# Altium schematic sheet wifi.schdoc
size A3; Hw_rev: 0; License: GPLv3; Address3: Firenze; Address4: ITALY; DocumentNumber: 7; Revision: 0; SheetNumber: 7; SheetTotal: 8
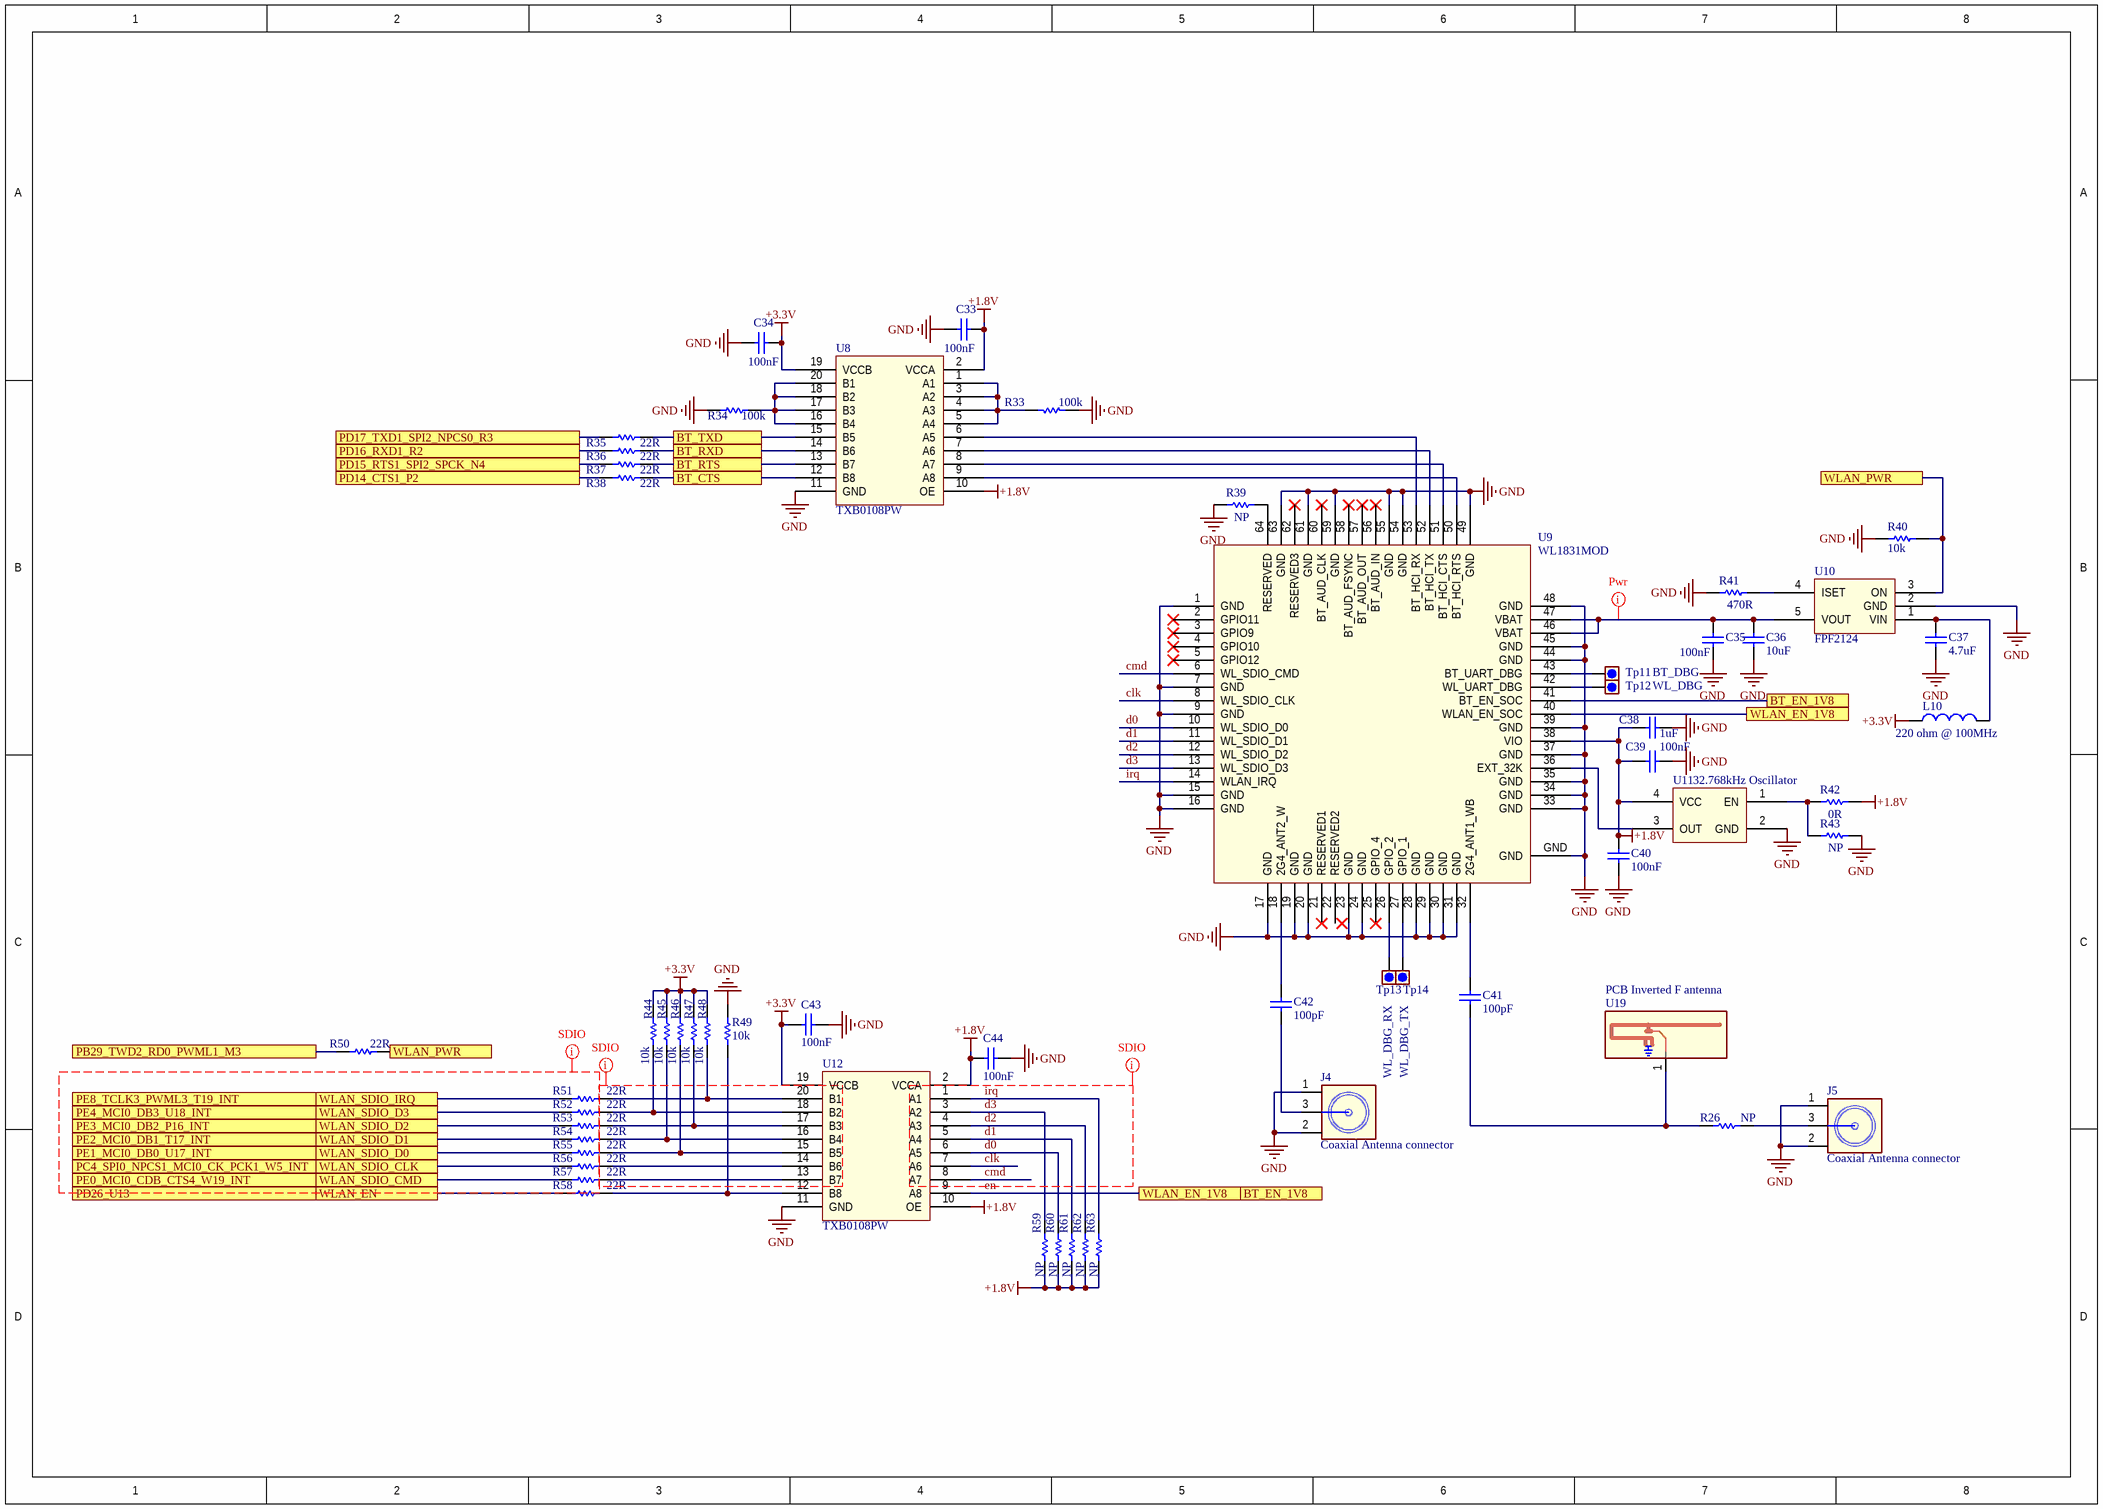
[diagram p0: wifi.schdoc]

## Parts
C33  100nF  [0603_[1608]]
C34  100nF  [0603_[1608]]
C35  100nF  [0603_[1608]]
C36  10uF  [1206_[3216]]
C37  4.7uF  [1206_[3216]]
C38  1uF  [0805_[2012]]
C39  100nF  [0603_[1608]]
C40  100nF  [0603_[1608]]
C41  100pF  [0402_[1005]]
C42  100pF  [0402_[1005]]
C43  100nF  [0603_[1608]]
C44  100nF  [0603_[1608]]
J4  Coaxial Antenna connector  [U.FL_COAXIAL_2.6x2.6MM_STRAIGHT_SMD]
J5  Coaxial Antenna connector  [U.FL_COAXIAL_2.6x2.6MM_STRAIGHT_SMD]
L10  220 ohm @ 100MHz  [0805_[2012]]
R26  NP  [0402_[1005]]
R33  100k  [0603_[1608]]
R34  100k  [0603_[1608]]
R35  22R  [0603_[1608]]
R36  22R  [0603_[1608]]
R37  22R  [0603_[1608]]
R38  22R  [0603_[1608]]
R39  NP  [0603_[1608]]
R40  10k  [0603_[1608]]
R41  470R  [0603_[1608]]
R42  0R  [0603_[1608]]
R43  NP  [0402_[1005]]
R44  10k  [0603_[1608]]
R45  10k  [0603_[1608]]
R46  10k  [0603_[1608]]
R47  10k  [0603_[1608]]
R48  10k  [0603_[1608]]
R49  10k  [0603_[1608]]
R50  22R  [0603_[1608]]
R51  22R  [0603_[1608]]
R52  22R  [0603_[1608]]
R53  22R  [0603_[1608]]
R54  22R  [0603_[1608]]
R55  22R  [0603_[1608]]
R56  22R  [0603_[1608]]
R57  22R  [0603_[1608]]
R58  22R  [0603_[1608]]
R59  NP  [0603_[1608]]
R60  NP  [0603_[1608]]
R61  NP  [0603_[1608]]
R62  NP  [0603_[1608]]
R63  NP  [0603_[1608]]
Tp11  BT_DBG  [TEST_POINT_SMD_D1MM]  (no BOM)
Tp12  WL_DBG  [TEST_POINT_SMD_D1MM]  (no BOM)
Tp13  WL_DBG_RX  [TEST_POINT_SMD_D1MM]  (no BOM)
Tp14  WL_DBG_TX  [TEST_POINT_SMD_D1MM]  (no BOM)
U8  TXB0108PW  [TSOP65P640X120-20L]
U9  WL1831MOD  [WL18XX_E-13.4X13.3-N100_0.75]
U10  FPF2124  [SOT-23-5]
U11  32.768kHz Oscillator  [CRYSTAL_3.2X1.5MM_4P_SMD]
U12  TXB0108PW  [TSOP65P640X120-20L]
U19  PCB Inverted F antenna  [ANTENNA_PCB_IFA]  (no BOM)

## Ports
BT_CTS, BT_EN_1V8, BT_RTS, BT_RXD, BT_TXD, PB29_TWD2_RD0_PWML1_M3, PC4_SPI0_NPCS1_MCI0_CK_PCK1_W5_INT, PD14_CTS1_P2, PD15_RTS1_SPI2_SPCK_N4, PD16_RXD1_R2, PD17_TXD1_SPI2_NPCS0_R3, PD26_U13, PE0_MCI0_CDB_CTS4_W19_INT, PE1_MCI0_DB0_U17_INT, PE2_MCI0_DB1_T17_INT, PE3_MCI0_DB2_P16_INT, PE4_MCI0_DB3_U18_INT, PE8_TCLK3_PWML3_T19_INT, WLAN_EN, WLAN_EN_1V8, WLAN_PWR, WLAN_SDIO_CLK, WLAN_SDIO_CMD, WLAN_SDIO_D0, WLAN_SDIO_D1, WLAN_SDIO_D2, WLAN_SDIO_D3, WLAN_SDIO_IRQ

## Nets
+1.8V: C33.2 C38.2 C39.2 C40.2 C44.2 R42.1 R59.1 R60.1 R61.1 R62.1 R63.1 U8.2(VCCA) U8.10(OE) U9.38(VIO) U11.4(VCC) U12.2(VCCA) U12.10(OE)
+3.3V: C34.2 C43.2 L10.2 R44.1 R45.1 R46.1 R47.1 R48.1 U8.19(VCCB) U12.19(VCCB)
GND: C33.1 C34.1 C35.1 C36.1 C37.1 C38.1 C39.1 C40.1 C43.1 C44.1 J4.1(GND) J4.2(GND) J5.1(GND) J5.2(GND) R33.2 R34.2 R39.2 R40.1 R41.2 R43.1 R49.1 U8.11(GND) U9.1(GND) U9.7(GND) U9.9(GND) U9.15(GND) U9.16(GND) U9.17(GND) U9.19(GND) U9.20(GND) U9.23(GND) U9.24(GND) U9.28(GND) U9.29(GND) U9.30(GND) U9.31(GND) U9.33(GND) U9.34(GND) U9.35(GND) U9.37(GND) U9.39(GND) U9.44(GND) U9.45(GND) U9.48(GND) U9.49(GND) U9.54(GND) U9.55(GND) U9.59(GND) U9.61(GND) U9.63(GND) U9.GND U10.2(GND) U11.2(GND) U12.11(GND)
BT_CTS: R38.2 U8.12(B8) ; port BT_CTS
BT_RTS: R37.2 U8.13(B7) ; port BT_RTS
BT_RXD: R36.2 U8.14(B6) ; port BT_RXD
BT_TXD: R35.2 U8.15(B5) ; port BT_TXD
clk: U9.8(WL_SDIO_CLK) U12.7(A6)
cmd: U9.6(WL_SDIO_CMD) U12.8(A7)
d0: R60.2 U9.10(WL_SDIO_D0) U12.6(A5)
d1: R61.2 U9.11(WL_SDIO_D1) U12.5(A4)
d2: R62.2 U9.12(WL_SDIO_D2) U12.4(A3)
d3: R59.2 U9.13(WL_SDIO_D3) U12.3(A2)
en: U9.40(WLAN_EN_SOC) U9.41(BT_EN_SOC) U12.9(A8) ; port WLAN_EN_1V8, port BT_EN_1V8
irq: R63.2 U9.14(WLAN_IRQ) U12.1(A1)
PB29_TWD2_RD0_PWML1_M3: R50.1 ; port PB29_TWD2_RD0_PWML1_M3
PC4_SPI0_NPCS1_MCI0_CK_PCK1_W5_INT: R56.2 ; port WLAN_SDIO_CLK, port PC4_SPI0_NPCS1_MCI0_CK_PCK1_W5_INT
PD14_CTS1_P2: R38.1 ; port PD14_CTS1_P2
PD15_RTS1_SPI2_SPCK_N4: R37.1 ; port PD15_RTS1_SPI2_SPCK_N4
PD16_RXD1_R2: R36.1 ; port PD16_RXD1_R2
PD17_TXD1_SPI2_NPCS0_R3: R35.1 ; port PD17_TXD1_SPI2_NPCS0_R3
PD26_U13: R58.2 ; port WLAN_EN, port PD26_U13
PE0_MCI0_CDB_CTS4_W19_INT: R57.2 ; port WLAN_SDIO_CMD, port PE0_MCI0_CDB_CTS4_W19_INT
PE1_MCI0_DB0_U17_INT: R55.2 ; port WLAN_SDIO_D0, port PE1_MCI0_DB0_U17_INT
PE2_MCI0_DB1_T17_INT: R54.2 ; port WLAN_SDIO_D1, port PE2_MCI0_DB1_T17_INT
PE3_MCI0_DB2_P16_INT: R53.2 ; port WLAN_SDIO_D2, port PE3_MCI0_DB2_P16_INT
PE4_MCI0_DB3_U18_INT: R52.2 ; port WLAN_SDIO_D3, port PE4_MCI0_DB3_U18_INT
PE8_TCLK3_PWML3_T19_INT: R51.2 ; port WLAN_SDIO_IRQ, port PE8_TCLK3_PWML3_T19_INT
WLAN_PWR: R40.2 R50.2 U10.3(ON) ; port WLAN_PWR
NetC35_2: C35.2 C36.2 U9.46(VBAT) U9.47(VBAT) U10.5(VOUT)
NetC37_2: C37.2 L10.1 U10.1(VIN)
NetC41_1: C41.1 U9.32(2G4_ANT1_WB)
NetC41_2: C41.2 R26.2 U19.1(SIGNAL)
NetC42_1: C42.1 U9.18(2G4_ANT2_W)
NetC42_2: C42.2 J4.3(SIG)
NetJ5_3: J5.3(SIG) R26.1
NetR33_1: R33.1 U8.1(A1) U8.3(A2) U8.4(A3) U8.5(A4)
NetR34_1: R34.1 U8.16(B4) U8.17(B3) U8.18(B2) U8.20(B1)
NetR39_1: R39.1 U9.64(RESERVED)
NetR41_1: R41.1 U10.4(ISET)
NetR42_2: R42.2 R43.2 U11.1(EN)
NetR44_2: R44.2 R52.1 U12.18(B2)
NetR45_2: R45.2 R54.1 U12.16(B4)
NetR46_2: R46.2 R55.1 U12.15(B5)
NetR47_2: R47.2 R53.1 U12.17(B3)
NetR48_2: R48.2 R51.1 U12.20(B1)
NetR49_2: R49.2 R58.1 U12.12(B8)
NetR56_1: R56.1 U12.14(B6)
NetR57_1: R57.1 U12.13(B7)
NetTp11_1: Tp11.1 U9.43(BT_UART_DBG)
NetTp12_1: Tp12.1 U9.42(WL_UART_DBG)
NetTp13_1: Tp13.1 U9.26(GPIO_2)
NetTp14_1: Tp14.1 U9.27(GPIO_1)
NetU8_6: U8.6(A5) U9.53(BT_HCI_RX)
NetU8_7: U8.7(A6) U9.52(BT_HCI_TX)
NetU8_8: U8.8(A7) U9.51(BT_HCI_CTS)
NetU8_9: U8.9(A8) U9.50(BT_HCI_RTS)
NetU9_36: U9.36(EXT_32K) U11.3(OUT)

Not connected (* = marked no-connect by the designer): U9 2(GPIO11)* 3(GPIO9)* 4(GPIO10)* 5(GPIO12)* 21(RESERVED1)* 22(RESERVED2) 25(GPIO_4)* 56(BT_AUD_IN)* 57(BT_AUD_OUT)* 58(BT_AUD_FSYNC)* 60(BT_AUD_CLK)* 62(RESERVED3)*

## Layout directives
net class Power: NetC35_2
net class SDIO_BUS: (no net found under the mark)
net class SDIO: (no net found under the mark)
net class SDIO_LOWBUS: clk, cmd, d0, d1, d2, d3, irq

## Library data of the parts
C33-C35 C38-C40 C43 C44 = Cap: Ceramic X7R 50V; Value: 10nF; Published: 8-Jun-2000; Revision: July-2002: Re-released for DXP Platform.; Publisher: Altium Limited
C36 = Cap: Ceramic X5R 25V; Value: 10nF; Published: 8-Jun-2000; Revision: July-2002: Re-released for DXP Platform.; Publisher: Altium Limited
C37 = Cap: Ceramic X7R 10V; Value: 10nF; Published: 8-Jun-2000; Revision: July-2002: Re-released for DXP Platform.; Publisher: Altium Limited
C41 C42 = Cap: Ceramic COG 50V; Value: 10nF; Published: 8-Jun-2000; Revision: July-2002: Re-released for DXP Platform.; Publisher: Altium Limited
J4 J5 = ANTENNA_3P_COAXIAL_CONNECTOR: U.FL serias
L10 = Inductor: WE 742792022
R26 R33-R63 = Res1: Resistor; Value: 1K; Published: 8-Jun-2000; Revision: July-2002: Re-released for DXP Platform.; Publisher: Altium Limited
Tp11-Tp14 = Test_point: Test point
U8 U12 = TXB0108PW: 8-bit bidirectional level translator
U9 = WL1831MOD: Wifi & Bluethoot module
U10 = FPF2124: Power Load Switch
U11 = Si501/2/3_32768Hz: 32.768kHz Oscillator (EPSON  X1B0002110001 SG-3030CM)
U19 = ANTENNA_PCB_IFA: PCB Antenna